# EAGLE design MySens-nRF52840_RFStar-V01-012 (EAGLE 9.2.2)
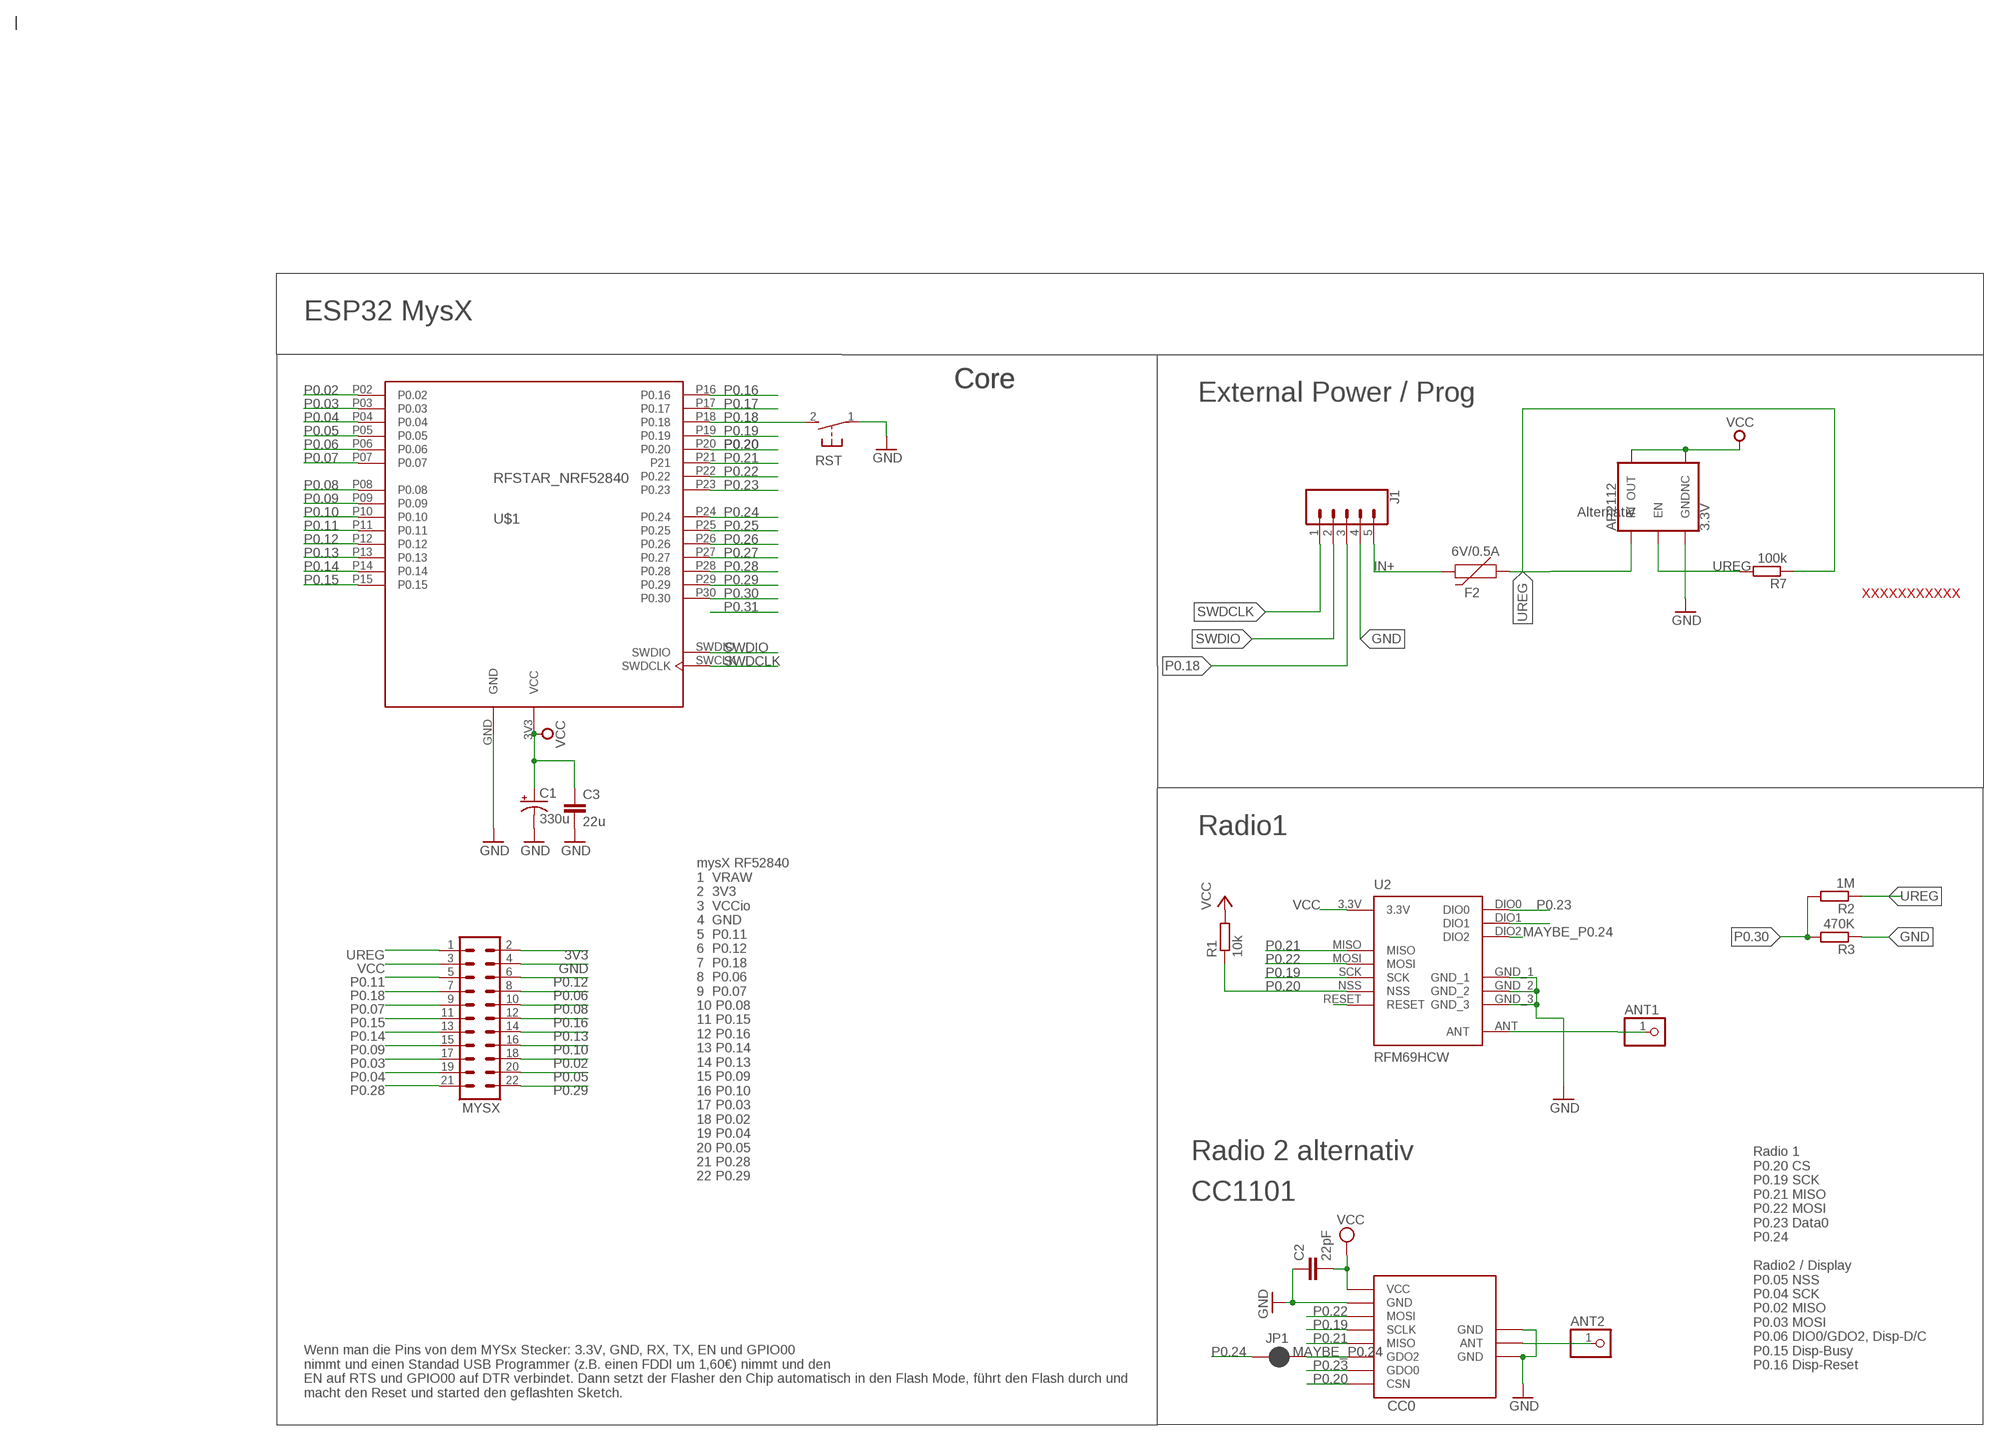
[diagram p0: schematic, sheet 1]

## Parts
ANT1  PINHD-1X1  [1X01]
ANT2  PINHD-1X1  [1X01]
AP2112  3.3V  V_REG_AP2112K-3.3V  [SOT23-5]
C1  330u  CAP_POLSMD  [VISHAY_C]
C2  22pF  C-EUC0805  [C0805]
C3  22u  C-EUC0805  [C0805]
CC0  CC1101  CC1101_MODULE1SMD  [CC1101_MODULE1_SMD]
F2  6V/0.5A  PPTC_HALF-AMP  [1206]
J1  CONN_05LOCK  [1X05_LOCK]
JP1  JUMPER-SMT_2_NC_PASTE_NO-SILK  [SMT-JUMPER_2_NC_PASTE_NO-SILK]
MYSX  MA11-2  [MA11-2]
R1  10k  R-EU_M0805  [M0805]
R2  1M  R-EU_M0805  [M0805]
R3  470K  R-EU_M0805  [M0805]
R7  100k  R-EU_M0805  [M0805]
RST  DTSM-3  [DTSM-3]
U2  RFM69HCW  [RFM69HCW-XXXS2]
U$1  RFSTAR_NRF52840  [RFSTAR_NRF52840]

## Nets
3V3: MYSX.2
ANT0: ANT2.1 CC0.ANT
ANT1: ANT1.1 U2.ANT
GND [gnd]: AP2112.2(GND) C1.- C2.1 C3.2 CC0.GND@0(GND) CC0.GND@1(GND) CC0.GND@2(GND) J1.4 MYSX.4 R3.1 RST.1 U2.GND_1 U2.GND_2 U2.GND_3 U$1.GND
IN+ [vcc]: F2.2 J1.5
MAYBE_P0.24: CC0.GDO2 JP1.2 U2.DIO2
N$1: AP2112.3(EN) R7.2
N$8: U2.DIO1
N$9: U2.RESET
P0.02: MYSX.18 U$1.P02(P0.02)
P0.03: MYSX.17 U$1.P03(P0.03)
P0.04: MYSX.19 U$1.P04(P0.04)
P0.05: MYSX.20 U$1.P05(P0.05)
P0.06: MYSX.8 U$1.P06(P0.06)
P0.07: MYSX.9 U$1.P07(P0.07)
P0.08: MYSX.10 U$1.P08(P0.08)
P0.09: MYSX.15 U$1.P09(P0.09)
P0.10: MYSX.16 U$1.P10(P0.10)
P0.11: MYSX.5 U$1.P11(P0.11)
P0.12: MYSX.6 U$1.P12(P0.12)
P0.13: MYSX.14 U$1.P13(P0.13)
P0.14: MYSX.13 U$1.P14(P0.14)
P0.15: MYSX.11 U$1.P15(P0.15)
P0.16: MYSX.12 U$1.P16(P0.16)
P0.17: U$1.P17(P0.17)
P0.18: J1.3 MYSX.7 RST.2 U$1.P18(P0.18)
P0.19: CC0.SCLK U2.SCK U$1.P19(P0.19)
P0.20: CC0.CSN R1.1 U2.NSS U$1.P20(P0.20)
P0.21: CC0.MISO U2.MISO U$1.P21
P0.22: CC0.MOSI U2.MOSI U$1.P22(P0.22)
P0.23: CC0.GDO0 U2.DIO0 U$1.P23(P0.23)
P0.24: JP1.1 U$1.P24(P0.24)
P0.25: U$1.P25(P0.25)
P0.26: U$1.P26(P0.26)
P0.27: U$1.P27(P0.27)
P0.28: MYSX.21 U$1.P28(P0.28)
P0.29: MYSX.22 U$1.P29(P0.29)
P0.30: R2.2 R3.2 U$1.P30(P0.30)
SWDCLK: J1.1 U$1.SWCLK(SWDCLK)
SWDIO: J1.2 U$1.SWDIO
UREG [gnd]: AP2112.1(IN) F2.1 MYSX.1 R2.1 R7.1
VCC [gnd]: AP2112.4(NC) AP2112.5(OUT) C1.+ C2.2 C3.1 CC0.VCC MYSX.3 R1.2 U2.3.3V U$1.3V3(VCC)

## Notes on the sheet
- ESP32 MysX
- Core | Core
- External Power / Prog
- Alternativ
- XXXXXXXXXXX
- Radio1
- Radio 2 alternativ
- mysX RF52840
  1  VRAW
  2  3V3
  3  VCCio
  4  GND
  5  P0.11
  6  P0.12
  7  P0.18
  8  P0.06
  9  P0.07
  10 P0.08
  11 P0.15
  12 P0.16
  13 P0.14
  14 P0.13
  15 P0.09
  16 P0.10
  17 P0.03
  18 P0.02
  19 P0.04
  20 P0.05
  21 P0.28
  22 P0.29
- CC1101
- Radio 1 
  P0.20 CS
  P0.19 SCK
  P0.21 MISO
  P0.22 MOSI
  P0.23 Data0
  P0.24 
  
  Radio2 / Display 
  P0.05 NSS
  P0.04 SCK
  P0.02 MISO
  P0.03 MOSI
  P0.06 DIO0/GDO2, Disp-D/C
  P0.15 Disp-Busy
  P0.16 Disp-Reset
- Wenn man die Pins von dem MYSx Stecker: 3.3V, GND, RX, TX, EN und GPIO00
  nimmt und einen Standad USB Programmer (z.B. einen FDDI um 1,60€) nimmt und den
  EN auf RTS und GPIO00 auf DTR verbindet. Dann setzt der Flasher den Chip automatisch in den Flash Mode, führt den Flash durch und
  macht den Reset und started den geflashten Sketch.

## Library data of the parts
ANT1 ANT2 = pinhead:PINHD-1X1: PIN HEADER
AP2112 = SparkFun-IC-Power:V_REG_AP2112: AP2112 - 600mA CMOS LDO Regulator w/ Enable The AP2112 is CMOS process low dropout linear regulator with enable function, the regulator delivers a guaranteed 600mA (min.) continuous load current. Features Output Voltage Accuracy: ±1.5% Output Current: 600mA (Min.) Foldback Short Current Protection: 50mA Enable Function to Turn ON/OFF VOUT Low Dropout Voltage (3.3V): 250mV (Typ.) @IOUT=600mA Excellent Load Regulation: 0.2%/A (Typ.) Excellent Line Regulation: 0.02%/V (Typ.) Low Quiescent Current: 55μA (Typ.) Low Standby Current: 0.01μA (Typ.) Low Output Noise: 50μVRMS PSRR: 100Hz -65dB, 1kHz -65dB OTSD Protection Stable with 1.0μF Flexible Cap: Ceramic, Tantalum and Aluminum Electrolytic Operation Temperature Range: -40°C to 85°C ESD: MM 400V, HBM 4000V; PROD_ID: VREG-12457
C1 = SparkFun-Passives:CAP_POL: Capacitor Polarized These are standard SMD and PTH capacitors. Normally 10uF, 47uF, and 100uF in electrolytic and tantalum varieties. Always verify the external diameter of the through hole cap, it varies with capacity, voltage, and manufacturer. The EIA devices should be standard.
C2 = rcl:C-EU: CAPACITOR, European symbol; SPICEPREFIX: C
C3 = rcl@1:C-EU: CAPACITOR, European symbol; SPICEPREFIX: C
CC0 = wireless:CC1101_MODULE1: CC1101 wireless module for 433/868 MHz (sold from Aliexpress). DIL version for mounting with pin header (and SMD soldering) and SMD only variant available.
F2 = SparkFun-Fuses:PPTC: Resettable Fuse PPTC Resettable Fuse. Really a sort of resistor with a polymeric positive temperature coefficient whose resistance increases dramatically with an increase in temperature. When heated by the power passing through the resistance rises causing the current to be limited, protecting the circuit. This is achieved by the transition of the polymer from a crystalline to an amorphous state where the conductive carbon separates breaking the conductive pathways found in the cool crystalline structure. When a PPTC cools back down it resumes conducting letting the circuit turn back on. SparkFun Products: SparkFun RedBoard - Programmed with Arduino <https://www.sparkfun.com/products/12757> Pro Micro - 5V/16MHz <https://www.sparkfun.com/products/12640> Arduino Pro 328 - 5V/16MHz <https://www.sparkfun.com/products/10915> MP3 Trigger <https://www.sparkfun.com/products/13720>; PROD_ID: RES-08585
J1 = SparkFun-Connectors:CONN_05: Multi connection point. Often used as Generic Header-pin footprint for 0.1 inch spaced/style header connections On any of the 0.1 inch spaced packages, you can populate with these: Break Away Headers - Straight <https://www.sparkfun.com/products/116> (PRT-00116) Break Away Male Headers - Right Angle <https://www.sparkfun.com/products/553> (PRT-00553) Female Headers <https://www.sparkfun.com/products/115> (PRT-00115) Break Away Headers - Machine Pin <https://www.sparkfun.com/products/117> (PRT-00117) Break Away Female Headers - Swiss Machine Pin <https://www.sparkfun.com/products/743> (PRT-00743) For SCREWTERMINALS and SPRING TERMINALS visit here: Screw Terimnals on SparkFun.com <https://www.sparkfun.com/search/results?term=Screw+Terminals> (5mm/3.5mm/2.54mm spacing) This device is also useful as a general connection point to wire up your design to another part of your project. Our various solder wires solder well into these plated through hole pads. Hook-Up Wire - Assortment (Stranded, 22 AWG) <https://www.sparkfun.com/products/11375> (PRT-11375) Hook-Up Wire - Assortment (Solid Core, 22 AWG) <https://www.sparkfun.com/products/11367> (PRT-11367) View the entire wire category on our website here <https://www.sparkfun.com/categories/141> Special notes: Molex polarized connector foot print use with SKU : PRT-08231 with associated crimp pins and housings. 1MM SMD Version SKU: PRT-10208
JP1 = SparkFun-Jumpers:JUMPER-SMT_2_NC_PASTE: Normally closed solder jumper This jumper has an aperture in the stencil to allow solder paste to bridge the split in the wire so it's normally closed (NC). Wick off the solder to open the connection. Reapply solder to reclose the connection.
MYSX = con-Pinheader:MA11-2: PIN HEADER; OC_FARNELL: unknown; OC_NEWARK: unknown
R1-R3 R7 = rcl:R-EU_: RESISTOR, European symbol; SPICEPREFIX: R
RST = switch-tact:DTSM-3
U2 = doug:RFM69H
U$1 = nRF52:RFSTAR_NRF52840

## Net classes
0 default: width 0.305 mm, clearance 0.205 mm
1 gnd: width 0.457 mm, drill 0.635 mm, clearance 0.254 mm
2 vcc: width 0.406 mm, drill 0.406 mm, clearance 0.254 mm

## Board
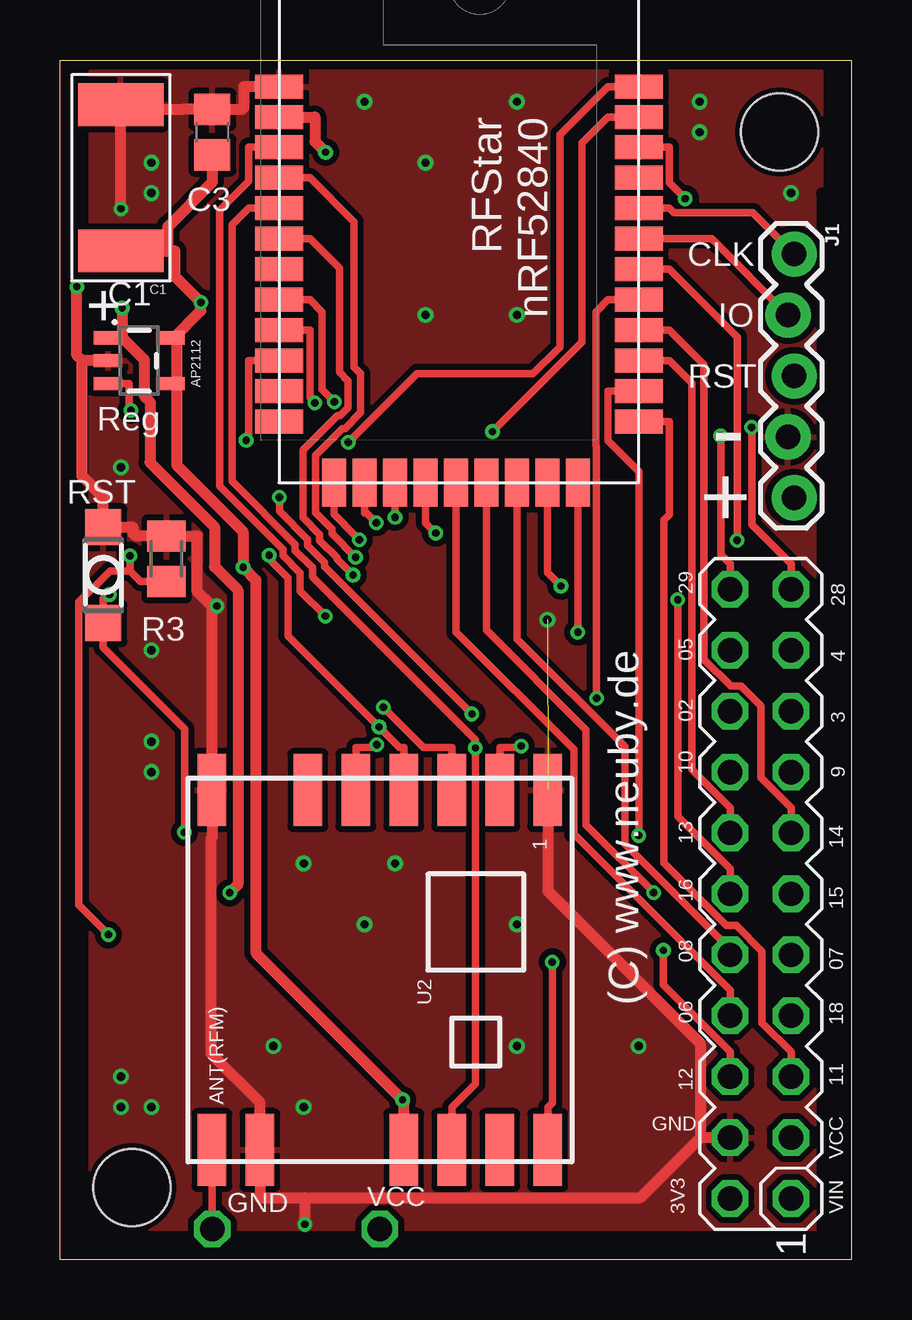
[diagram p1: board, top side]
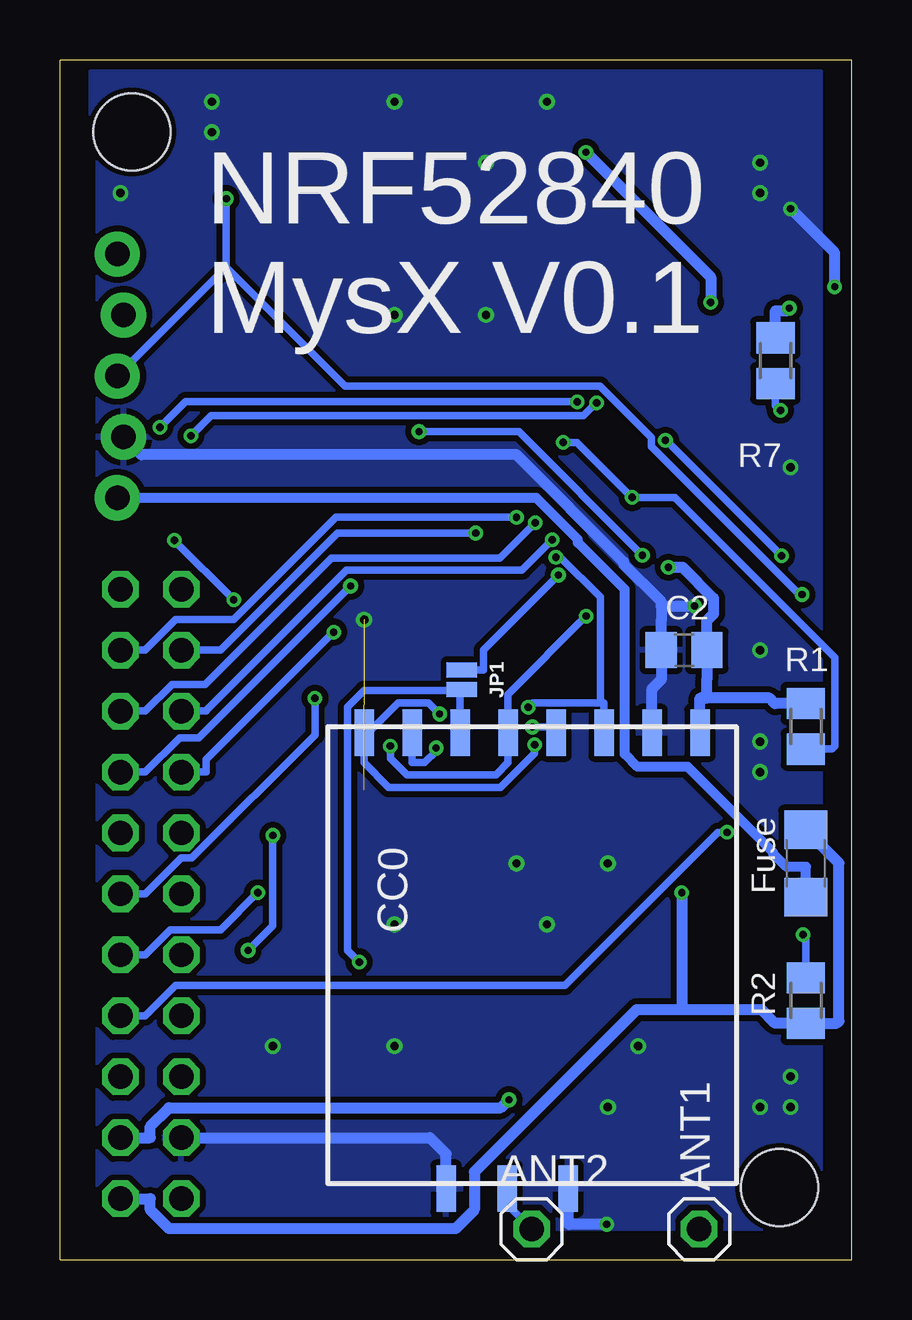
[diagram p2: board, bottom side, seen from below]

Size 33 x 50 mm. Coordinates in mm from the lower left corner, seen from the top.
Outline: 0,0 0,50 33,50 33,0 0,0
Copper layers (1*16): Top 0.035mm / dielectric 1.5mm / Bottom 0.035mm
Design rules "dirt_cheap_dirty_boards.v1": minimum track width 5mil, minimum drill 12mil, track to track 5mil, track to pad 5mil, pad to pad 5mil, via to via 5mil, smd to smd 0mil, copper to edge 10mil, drill to drill 10mil, minimum pad ring 10mil, minimum via ring 6mil, stop-mask expansion 2mil, vias tented up to drill 25mil, thermal gap 10mil
Holes 3.2 mm at 3,3 30,47
tRestrict: area 31.8,0.6 to 33,44.5
bRestrict: area 31.8,1.3 to 33,45.7

### Footprints (pad centres in the part's own frame; a part is rotated, then mirrored left to right if it is on the bottom)
1X01 = drill 1.016 octagon: 1 0,0
SOT23-5 = smd 0.55 x 1.2: 1 -0.95,-1.3; 2 0,-1.3; 3 0.95,-1.3; 4 0.95,1.3; 5 -0.95,1.3
VISHAY_C = smd 3.556 x 1.778: + 0,3.048; - 0,-3.048
C0805 = smd 1.3 x 1.5: 1 -0.95,0; 2 0.95,0
CC1101_MODULE1_SMD = smd 1.93 x 0.813: ANT 19,5.96; CSN 0,0; GDO0 0,2; GDO2 0,4; GND@0 0,12; GND@1 19,8.5; GND@2 19,3.42; MISO 0,6; MOSI 0,10; SCLK 0,8; VCC 0,14
1206 = smd 1.6 x 1.8: 1 -1.4,0; 2 1.4,0
1X05_LOCK = drill 1.016 pad 1.88: 1 0,0.127; 2 2.54,-0.127; 3 5.08,0.127; 4 7.62,-0.127; 5 10.16,0.127
SMT-JUMPER_2_NC_PASTE_NO-SILK = smd 0.635 x 1.27: 1 -0.406,0; 2 0.406,0
MA11-2 = drill 1.016 octagon: 1 -12.7,-1.27; 2 -12.7,1.27; 3 -10.16,-1.27; 4 -10.16,1.27; 5 -7.62,-1.27; 6 -7.62,1.27; 7 -5.08,-1.27; 8 -5.08,1.27; 9 -2.54,-1.27; 10 -2.54,1.27; 11 0,-1.27; 12 0,1.27; 13 2.54,-1.27; 14 2.54,1.27; 15 5.08,-1.27; 16 5.08,1.27; 17 7.62,-1.27; 18 7.62,1.27; 19 10.16,-1.27; 20 10.16,1.27; 21 12.7,-1.27; 22 12.7,1.27
M0805 = smd 1.3 x 1.6: 1 -0.95,0; 2 0.95,0
DTSM-3 = smd 1.5 x 1.5: 1 -2,0; 2 2,0
RFM69HCW-XXXS2 = smd 3 x 1.2: 3.3V 7.5,1; ANT 7.5,-7; DIO0 7.5,3; DIO1 7.5,5; DIO2 7.5,7; GND_1 7.5,-5; GND_2 -7.5,-7; GND_3 -7.5,7; MISO -7.5,5; MOSI -7.5,3; NSS -7.5,-1; RESET -7.5,-3; SCK -7.5,1
RFSTAR_NRF52840 = smd 1 x 2: 3V3 15.24,14.986; GND 16.51,14.986; P11 2.54,0; P12 3.81,0; P13 5.08,0; P14 6.35,0; P15 7.62,0; P16 8.89,0; P17 12.7,0; P18 13.97,0; P19 15.24,0; P20 16.51,0; P21 13.97,14.986; P22 12.7,14.986; P23 11.43,14.986; P24 10.16,14.986; P25 8.89,14.986; P26 3.81,14.986; P27 2.54,14.986; P28 7.62,14.986; P29 6.35,14.986; P30 5.08,14.986; SWCLK 11.43,0; SWDIO 10.16,0 | smd 2 x 1: P02 0,12.7; P03 0,11.43; P04 0,10.16; P05 0,8.89; P06 0,7.62; P07 0,6.35; P08 0,5.08; P09 0,3.81; P10 0,2.54

### Placement (x,y rotation side)
ANT1  6.35,1.27 0 bottom
ANT2  13.34,1.27 0 bottom
AP2112  3.3,37.47 270 top
C1  2.54,45.09 180 top
C2  6.99,25.4 0 bottom
C3  6.35,46.99 90 top
CC0  20.32,21.95 270 bottom
F2  1.91,16.51 270 bottom
J1  30.48,41.91 270 top
JP1  16.25,24.16 270 bottom
MYSX  29.21,15.24 90 top
R1  1.91,22.23 90 bottom
R2  1.91,10.79 90 bottom
R3  4.45,29.21 270 top
R7  3.17,37.47 270 bottom
RST  1.81,28.53 270 top
U2  13.34,12.06 270 top
U$1  24.13,32.38 90 top

### Tracks (layer width: path | path; a pad name or v marks a point on that pad's centre or on a via)
ANT0
  Bottom 0.305: 13.78,1.71 13.65,1.59 | 13.65,1.59 ANT2.1 | CC0.ANT 14.36,2.29 13.65,1.59
ANT1
  Top 0.305: ANT1.1 6.35,2.31 6.33,2.33 U2.ANT
GND  (via drill 0.3 pad 0.61, 0.35)  (1 unrouted)
  Top 0.457: 10.21,2.58 24.2,2.58 26.7,5.08 | 10.21,2.58 8.34,2.58 U2.GND_1 8.34,6.55 6.29,8.59 6.29,17.54 6.33,17.58 U2.GND_2 6.33,21.55 6.33,27.24 | 10.21,2.58 v10.21,1.47 | 0.92,37.47 0.7,37.68 v0.7,40.55 | 0.92,37.47 0.92,32.65 1.81,31.76 RST.1 2.17,30.53 3.04,30.53 3.04,30.28 3.16,30.16 R3.1 5.73,30.16 5.73,27.84 6.33,27.24 | v2.54,43.8 C1.- 3.67,48.13 3.86,47.94 5.12,47.94 C3.2 6.97,47.94 7.58,47.94 7.66,48.02 7.66,48.9 U$1.GND | AP2112.2 0.92,37.47 | U2.GND_3 20.34,15.37 26.7,9.01 26.7,5.08 | MYSX.4 26.7,5.08 | 6.33,27.24 v6.54,27.24
  Bottom 0.457: CC0.GND@1 11.82,1.51 11.78,1.47 v10.21,1.47 | 7.93,27.24 7.93,27.42 9.5,28.99 9.5,29.08 13.97,33.54 29.61,33.54 J1.4 | v0.7,40.55 0.7,41.96 v2.54,43.8 | CC0.GND@2 16.9,4.4 17.58,5.08 MYSX.4 | 7.93,27.24 7.93,26.63 C2.1 7.93,24.17 8.32,23.78 CC0.GND@0 | 7.93,27.24 v6.54,27.24
  other vias: 3.81,45.72 12.7,48.26 19.05,48.26 15.24,45.72 15.24,39.37 19.05,39.37 26.67,48.26 26.67,46.99 30.48,44.45 3.81,44.45 2.54,33.02 3.81,25.4 3.81,21.59 3.81,20.32 20.32,26.67 13.97,16.51 10.16,16.51 12.7,13.97 19.05,13.97 10.16,6.35 2.54,7.62 2.54,6.35 3.81,6.35 8.89,8.89 24.13,8.89 19.05,8.89
  pour Top: 1.27,1.27 1.27,49.53 31.75,49.53 31.75,1.27
  pour Bottom: 1.27,49.53 31.75,49.53 31.75,1.27 1.27,1.27
IN+
  Bottom 0.406: J1.5 13.14,31.75 12.39,31 11.41,30.02 11.41,29.88 9.46,27.93 9.46,21.07 8.92,20.53 6.83,20.53 3.26,16.96 3.26,16.92 2.71,16.37 1.91,16.37 F2.2
MAYBE_P0.24  (via drill 0.3 pad 0.61)
  Top 0.305: U2.DIO2 20.34,6.34 20.53,6.54 v20.53,12.4
  Bottom 0.305: 16.32,23.71 CC0.GDO2 | JP1.2 16.27,23.76 16.32,23.71 | v20.53,12.4 21.01,12.88 21.01,23.04 20.33,23.71 16.32,23.71
N$1  (via drill 0.3 pad 0.61)
  Top 0.305: AP2112.3 2.88,36.52 2.88,35.48 v2.96,35.4
  Bottom 0.305: R7.2 3.17,35.59 3.15,35.59 v2.96,35.4
P0.02  (via drill 0.3 pad 0.61)
  Top 0.305: v12.47,30 11.85,30.63 11.85,30.65 11.43,31.07 11.43,31.11 U$1.P02
  Bottom 0.305: v12.47,30 13.75,28.73 21.05,28.73 26.9,22.89 26.9,22.86 MYSX.18
P0.03  (via drill 0.3 pad 0.61)
  Top 0.305: U$1.P03 12.7,31.11 12.79,31.11 v13.18,30.71
  Bottom 0.305: v13.18,30.71 14.65,29.24 21.68,29.24 26.95,23.97 28.33,23.97 29.44,22.86 MYSX.17
P0.04  (via drill 0.3 pad 0.61)
  Top 0.305: v13.97,30.94 13.97,31.11 U$1.P04
  Bottom 0.305: v13.97,30.94 21.49,30.94 25.76,26.67 28.17,26.67 29.44,25.4 MYSX.19
P0.05  (via drill 0.3 pad 0.61)
  Top 0.305: U$1.P05 15.24,30.7 v15.66,30.28
  Bottom 0.305: MYSX.20 26.31,25.4 21.43,30.28 v15.66,30.28
P0.06
  Top 0.305: U$1.P06 16.51,26.16 21.42,21.25 21.42,17.75 27.94,11.23 MYSX.8
P0.07  (via drill 0.3 pad 0.61)
  Top 0.305: U$1.P07 17.78,26.23 21.93,22.08 21.93,18.12 v24.75,15.29
  Bottom 0.305: MYSX.9 29.44,12.7 28.4,13.74 26.31,13.74 v24.75,15.29
P0.08
  Top 0.305: U$1.P08 19.05,31.11 | MYSX.10 27.94,12.93 23.54,17.33 23.54,21.38 19.05,25.87 19.05,31.11 | 19.05,31.11
P0.09  (via drill 0.3 pad 0.61)
  Top 0.305: U$1.P09 20.32,28.64 v20.88,28.07
  Bottom 0.305: v20.88,28.07 27.21,21.75 28.01,21.75 29.44,20.32 MYSX.15
P0.10  (via drill 0.3 pad 0.61)
  Top 0.305: v21.59,26.15 21.59,31.11 U$1.P10
  Bottom 0.305: v21.59,26.15 26.9,20.84 26.9,20.32 MYSX.16
P0.11
  Top 0.305: MYSX.5 30.48,8.66 29.27,9.87 29.27,12.85 28.2,13.92 27.78,13.92 25.17,16.53 25.17,30.82 25.41,31.05 25.41,34.92 U$1.P11
P0.12  (via drill 0.3 pad 0.61)
  Top 0.305: v24.13,17.68 24.13,32.85 22.85,34.13 22.85,36.2 U$1.P12 | MYSX.6 27.94,8.66 25.16,11.44 v25.16,12.88
  Bottom 0.305: v25.16,12.88 24.13,13.91 v24.13,17.68
P0.13
  Top 0.305: MYSX.14 27.94,18.82 26.34,20.42 26.34,36.53 25.41,37.47 U$1.P13
P0.14
  Top 0.305: MYSX.13 30.48,18.82 29.21,20.09 29.21,23.07 28.38,23.9 27.96,23.9 26.85,25.01 26.85,37.29 25.41,38.73 U$1.P14
P0.15  (via drill 0.3 pad 0.61)
  Top 0.305: v22.37,23.4 22.37,33.89 22.34,33.92 22.34,39.49 22.85,40.01 U$1.P15
  Bottom 0.305: v22.37,23.4 22.37,21.87 27.5,16.74 27.94,16.74 29.44,15.24 MYSX.11
P0.16  (via drill 0.3 pad 0.61)
  Top 0.305: U$1.P16 25.41,41.27 28.23,38.45 v28.23,29.98 | MYSX.12 27.94,16.28 25.76,18.46 v25.76,27.5
  Bottom 0.305: v28.23,29.98 v25.76,27.5
P0.18  (via drill 0.3 pad 0.61)
  Top 0.305: v2.06,27.72 1.9,27.56 1.81,27.56 RST.2 1.81,26.02 1.81,25.5 5.19,22.12 v5.19,17.8 | U$1.P18 25.41,46.35 25.41,44.88 v26.07,44.22
  Bottom 0.305: v5.19,17.8 5.56,17.8 11.94,11.43 28.17,11.43 29.44,10.16 MYSX.7 | 26.07,41.37 21.11,36.41 10.5,36.41 8.35,34.25 8.35,33.89 2.17,27.72 v2.06,27.72 | 26.07,41.37 J1.3 | v26.07,44.22 26.07,41.37
P0.19  (via drill 0.3 pad 0.61)
  Top 0.305: v8.72,29.35 8.72,29.2 9.51,28.41 9.51,25.99 v13.3,22.2 14.15,21.34 14.34,21.34 U2.SCK | v18.03,34.51 21.77,38.24 21.77,46.54 22.85,47.62 U$1.P19
  Bottom 0.305: v18.03,34.51 13.87,34.51 v8.72,29.35 | CC0.SCLK 12.56,22.2 v13.3,22.2
P0.20  (via drill 0.3 pad 0.61)
  Top 0.305: v17.17,22.74 11.03,28.88 11.03,29.05 10.32,29.76 10.32,30.02 9.15,31.19 v9.15,31.77 | v12.02,34.06 14.88,36.92 19.72,36.92 20.83,38.03 20.83,46.88 22.85,48.9 U$1.P20 | U2.NSS 12.34,21.34 13.1,21.34 v13.21,21.46
  Bottom 0.305: 20.32,21.79 18.91,23.2 17.63,23.2 v17.17,22.74 | v12.02,34.06 11.44,34.06 v9.15,31.77 7.36,31.77 0.69,25.1 0.69,21.41 0.83,21.27 R1.1 | 20.32,21.79 20.32,20.71 19.29,19.68 14.63,19.68 13.21,21.1 v13.21,21.46 | CC0.CSN 20.32,21.79
P0.21  (via drill 0.3 pad 0.61)
  Top 0.305: v11.06,26.82 10.02,27.87 10.02,28.62 9.3,29.34 9.3,29.59 6.66,32.23 6.66,43.74 7.87,44.95 7.87,46.35 U$1.P21 | U2.MISO 18.34,21.34 19.17,21.34 v19.23,21.4
  Bottom 0.305: v11.06,26.82 14.32,23.56 CC0.MISO 14.32,20.71 14.83,20.2 18.53,20.2 19.23,20.89 v19.23,21.4
P0.22  (via drill 0.3 pad 0.61)
  Top 0.305: v12.32,29.27 11.34,30.25 11.34,30.44 10.65,31.13 10.65,33.52 11.77,34.65 11.88,34.65 12.53,35.29 12.53,36.92 12.27,37.19 12.27,43.24 10.42,45.09 U$1.P22 | U2.MOSI 16.34,21.34 15.15,21.34 v13.48,23.02
  Bottom 0.305: 10.48,23.2 10.32,23.2 CC0.MOSI | v13.48,23.02 13.3,23.2 10.48,23.2 | v12.32,29.27 12.13,29.27 10.48,27.62 10.48,23.2
P0.23  (via drill 0.3 pad 0.61)
  Top 0.305: U$1.P23 7.87,43.81 7.18,43.13 7.18,32.44 9.81,29.81 9.81,29.55 10.52,28.83 10.52,28.45 17.32,21.66 v17.32,21.32 17.32,7.33 16.34,6.34 U2.DIO0
  Bottom 0.305: v17.32,21.32 17.32,21.19 17.8,20.71 18.32,20.71 CC0.GDO0
P0.24  (via drill 0.3 pad 0.61)
  Top 0.305: v12.22,28.53 11.54,29.2 11.54,29.26 10.83,29.97 10.83,30.23 10.14,30.92 10.14,33.73 11.57,35.17 11.68,35.17 12.02,35.51 12.02,36.61 11.65,36.98 11.65,41.32 10.42,42.55 U$1.P24
  Bottom 0.305: JP1.1 15.34,24.57 15.34,25.41 v12.22,28.53
P0.28  (via drill 0.3 pad 0.61)
  Top 0.305: v11.44,35.75 10.93,36.26 10.93,39.49 10.42,40.01 U$1.P28 | v28.84,34.69 28.84,30.62 30.48,28.98 MYSX.21
  Bottom 0.305: v28.84,34.69 27.77,35.75 v11.44,35.75
P0.29  (via drill 0.3 pad 0.61)
  Top 0.305: U$1.P29 10.42,38.73 10.42,35.92 v10.63,35.71 | MYSX.22 27.94,28.98 27.54,29.38 v27.54,34.33
  Bottom 0.305: v10.63,35.71 11.17,35.17 26.71,35.17 v27.54,34.33
P0.30  (via drill 0.3 pad 0.61)
  Top 0.305: 2.92,28.71 2.09,28.71 0.78,27.4 0.78,14.78 v2.02,13.54 | 2.92,28.71 3.37,28.26 R3.2 | 2.92,28.71 | 2.92,28.71 v2.92,29.34 | U$1.P30 7.87,37.47 7.87,34.25 v7.76,34.14
  Bottom 0.305: v7.76,34.14 7.72,34.14 v2.92,29.34 | R2.2 1.91,13.42 v2.02,13.54
SWDCLK
  Top 0.305: J1.1 28.88,43.64 25.59,43.64 25.41,43.81 U$1.SWCLK
SWDIO
  Top 0.305: U$1.SWDIO 27.18,42.55 J1.2
UREG  (via drill 0.3 pad 0.61)
  Top 0.457: 2.59,38.41 2.61,38.41 3.52,37.51 3.52,35.99 3.75,35.76 3.75,33.22 6.44,30.54 6.44,28.88 7.42,27.9 7.42,15.63 v7.08,15.29 | v2.59,39.66 2.59,38.41 | AP2112.1 2.59,38.41
  Bottom 0.457: 7.08,10.41 8.97,10.41 15.72,3.66 15.72,2.08 16.51,1.29 28.46,1.29 29.23,2.07 29.23,2.54 MYSX.1 | 7.08,10.41 3.75,10.41 3.19,9.85 R2.1 0.62,9.85 0.52,9.95 0.52,16.53 F2.1 | v7.08,15.29 7.08,10.41 | R7.1 3.17,39.55 2.7,39.55 v2.59,39.66
VCC  (via drill 0.3 pad 0.61)
  Top 0.457: 4.87,36.52 4.87,33.11 7.63,30.35 v7.63,28.86 8.16,28.33 8.16,12.78 v14.28,6.66 14.34,6.6 14.34,6.55 U2.3.3V | 4.74,38.41 5.87,39.55 v5.87,39.9 4.8,40.97 4.8,42.04 4.5,42.04 | C3.1 6.35,44.91 4.5,43.06 4.5,42.04 | C1.+ 4.5,42.04 | 4.74,38.41 4.87,38.41 4.87,36.52 | AP2112.5 4.74,38.41 | U$1.3V3 10.63,47.62 10.63,46.6 v11.07,46.15 | AP2112.4 4.87,36.52
  Bottom 0.457: v7.63,28.86 7.05,28.86 5.75,27.56 5.75,26.92 6.04,26.63 C2.2 6.04,24.17 6.04,23.4 | v11.07,46.15 5.87,40.96 v5.87,39.9 | 6.04,23.4 6.32,23.4 CC0.VCC | 6.04,23.4 3.42,23.4 3.19,23.18 R1.2 | MYSX.3 29.23,5.08 29.23,5.55 28.46,6.33 14.62,6.33 v14.28,6.66

### Text on the board
tNames: C3 | C1 | CLK | IO | Reg | RST | - | RST | + | 29 | 28 | R3 | 05 | (C) www.neuby.de | 4 | 02 | 3 | 10 | 9 | 13 | 14 | 16 | 15 | 08 | 07 | ANT(RFM) | 06 | 18 | 12 | 11 | GND | VCC | GND | VCC | 3V3 | VIN
bNames: NRF52840 / MysX V0.1 | R7 | C2 | R1 | Fuse | R2
Document: DS_1551K